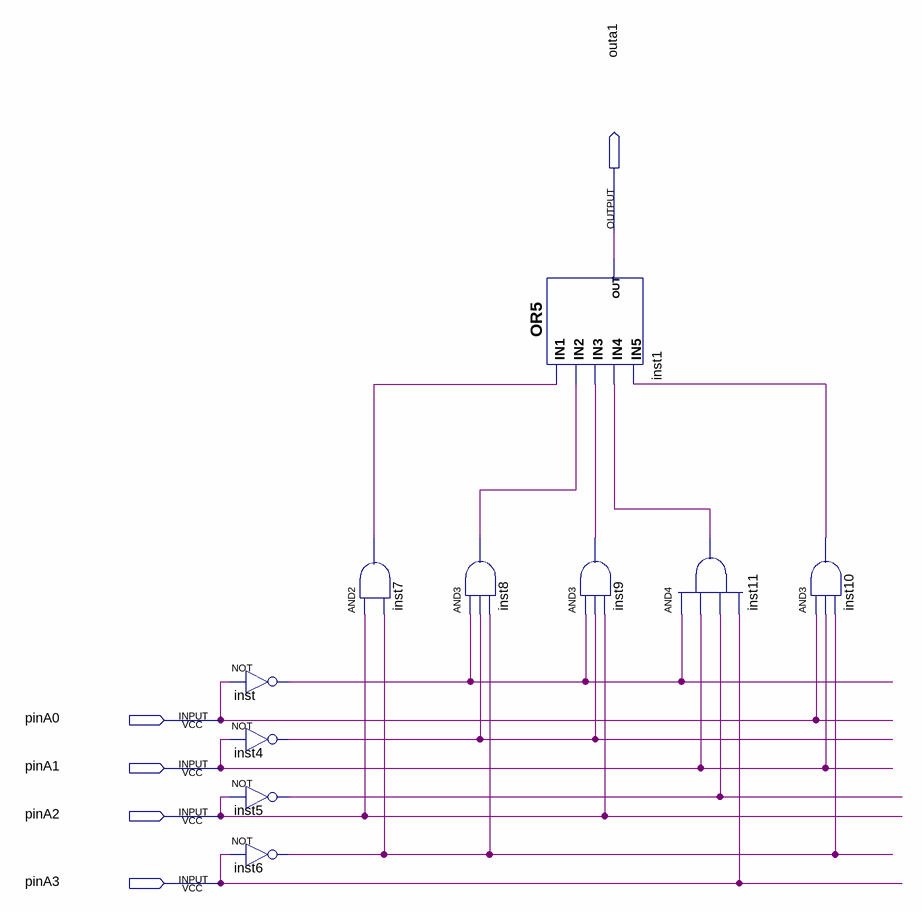
[diagram p0: schematic sheet]
// Quartus schematic OriginalA.bdf as structural Verilog: 10 symbols, 5 pins
module OriginalA (
  input  pinA0,
  input  pinA1,
  input  pinA2,
  input  pinA3,
  output outa1
);

  wire inst4_out, inst5_out, inst6_out, inst7_out, inst8_out, inst9_out, inst10_out, inst11_out, inst_out;

  not inst (inst_out, pinA0);
  not inst4 (inst4_out, pinA1);
  not inst5 (inst5_out, pinA2);
  not inst6 (inst6_out, pinA3);
  and inst7 (inst7_out, pinA2, inst6_out);
  and inst8 (inst8_out, inst_out, inst4_out, inst6_out);
  or inst1 (outa1, inst7_out, inst8_out, inst9_out, inst11_out, inst10_out);
  and inst9 (inst9_out, inst_out, inst4_out, pinA2);
  and inst11 (inst11_out, inst_out, pinA1, inst5_out, pinA3);
  and inst10 (inst10_out, pinA0, pinA1, inst6_out);
endmodule
